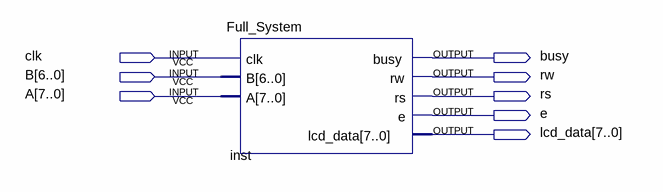
[diagram p0: schematic sheet]
// Quartus schematic Restoring_Divider.bdf as structural Verilog: 1 symbols, 8 pins
module Restoring_Divider (
  input  clk,
  input  [6:0] B,
  input  [7:0] A,
  output busy,
  output rw,
  output rs,
  output e,
  output [7:0] lcd_data
);

  Full_System inst (.clk(clk), .B(B), .A(A), .busy(busy), .rw(rw), .rs(rs), .e(e), .lcd_data(lcd_data));
endmodule
